# EAGLE design heimdall5 (EAGLE 8.6.3)
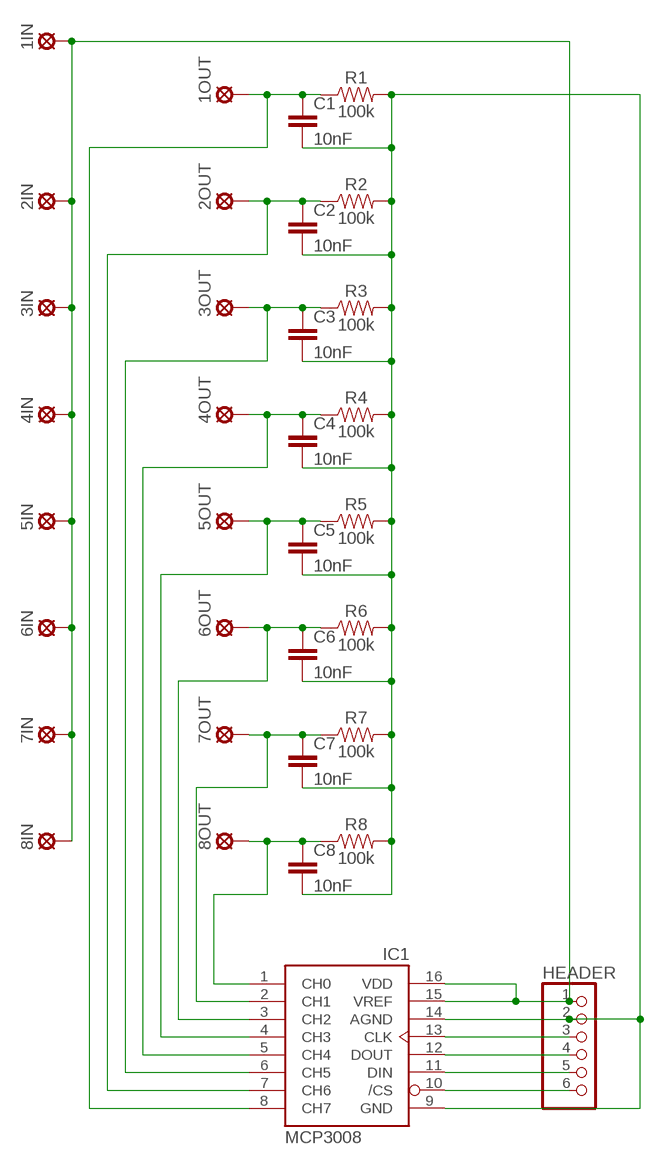
[diagram p0: schematic, sheet 1]

## Parts
1IN  LSP11  [LSP11]
1OUT  LSP11  [LSP11]
2IN  LSP11  [LSP11]
2OUT  LSP11  [LSP11]
3IN  LSP11  [LSP11]
3OUT  LSP11  [LSP11]
4IN  LSP11  [LSP11]
4OUT  LSP11  [LSP11]
5IN  LSP11  [LSP11]
5OUT  LSP11  [LSP11]
6IN  LSP11  [LSP11]
6OUT  LSP11  [LSP11]
7IN  LSP11  [LSP11]
7OUT  LSP11  [LSP11]
8IN  LSP11  [LSP11]
8OUT  LSP11  [LSP11]
C1  10nF  050X030_0502  [050X030_050]
C2  10nF  050X030_0502  [050X030_050]
C3  10nF  050X030_0502  [050X030_050]
C4  10nF  050X030_0502  [050X030_050]
C5  10nF  050X030_0502  [050X030_050]
C6  10nF  050X030_0502  [050X030_050]
C7  10nF  050X030_0502  [050X030_050]
C8  10nF  050X030_0502  [050X030_050]
HEADER  PINHD-1X6  [1X06]
IC1  MCP3008  [DIL16]
R1  100k  100KOHM-HORIZ-1/4W-1%  [AXIAL-0.3]
R2  100k  100KOHM-HORIZ-1/4W-1%  [AXIAL-0.3]
R3  100k  100KOHM-HORIZ-1/4W-1%  [AXIAL-0.3]
R4  100k  100KOHM-HORIZ-1/4W-1%  [AXIAL-0.3]
R5  100k  100KOHM-HORIZ-1/4W-1%  [AXIAL-0.3]
R6  100k  100KOHM-HORIZ-1/4W-1%  [AXIAL-0.3]
R7  100k  100KOHM-HORIZ-1/4W-1%  [AXIAL-0.3]
R8  100k  100KOHM-HORIZ-1/4W-1%  [AXIAL-0.3]

## Nets
GND: C1.2 C2.2 C3.2 C4.2 C5.2 C6.2 C7.2 C8.2 HEADER.2 IC1.9(GND) IC1.14(AGND) R1.P$2 R2.P$2 R3.P$2 R4.P$2 R5.P$2 R6.P$2 R7.P$2 R8.P$2
N$2: 2OUT.MP C2.1 IC1.7(CH6) R2.P$1
N$3: 7OUT.MP C7.1 IC1.2(CH1) R7.P$1
N$4: 3OUT.MP C3.1 IC1.6(CH5) R3.P$1
N$5: 4OUT.MP C4.1 IC1.5(CH4) R4.P$1
N$6: 5OUT.MP C5.1 IC1.4(CH3) R5.P$1
N$7: 6OUT.MP C6.1 IC1.3(CH2) R6.P$1
N$8: 8OUT.MP C8.1 IC1.1(CH0) R8.P$1
N$9: 1OUT.MP C1.1 IC1.8(CH7) R1.P$1
N$11: HEADER.3 IC1.13(CLK)
N$12: HEADER.4 IC1.12(DOUT)
N$13: HEADER.5 IC1.11(DIN)
N$14: HEADER.6 IC1.10(/CS)
PWR: 1IN.MP 2IN.MP 3IN.MP 4IN.MP 5IN.MP 6IN.MP 7IN.MP 8IN.MP HEADER.1 IC1.15(VREF) IC1.16(VDD)

## Library data of the parts
1IN 1OUT 2IN 2OUT 3IN 3OUT 4IN 4OUT 5IN 5OUT 6IN 6OUT 7IN 7OUT 8IN 8OUT = solpad:LSP11: SOLDER PAD drill 1.1 mm
C1-C8 = gm-caps-ceramic:050X030_050: 120 - 150pF Xicon Ceramic Disc 5mm lead spacing
HEADER = adafruit:PINHD-1X6: PIN HEADER
IC1 = adafruit:MCP3008
R1-R8 = SparkFun-Resistors:100KOHM: 100kΩ resistor A resistor is a passive two-terminal electrical component that implements electrical resistance as a circuit element. Resistors act to reduce current flow, and, at the same time, act to lower voltage levels within circuits. - Wikipedia; PROD_ID: RES-12184

## Board
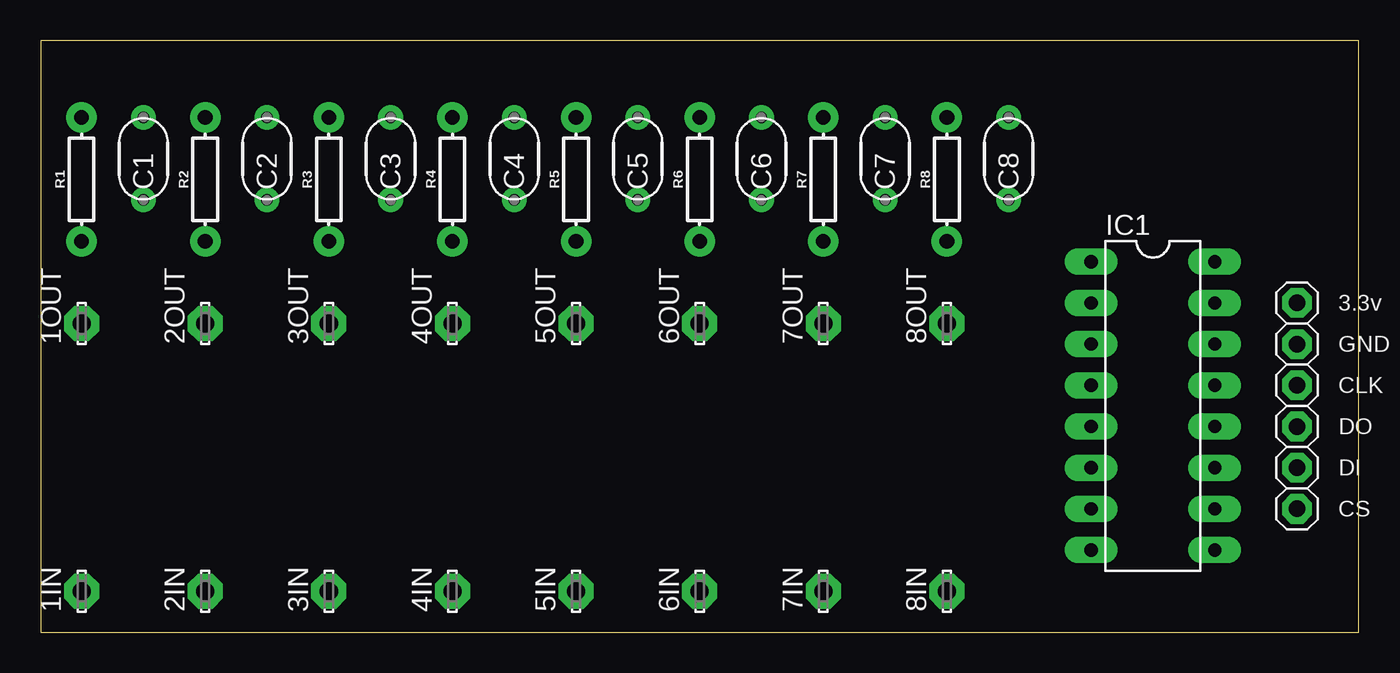
[diagram p1: board, top side]
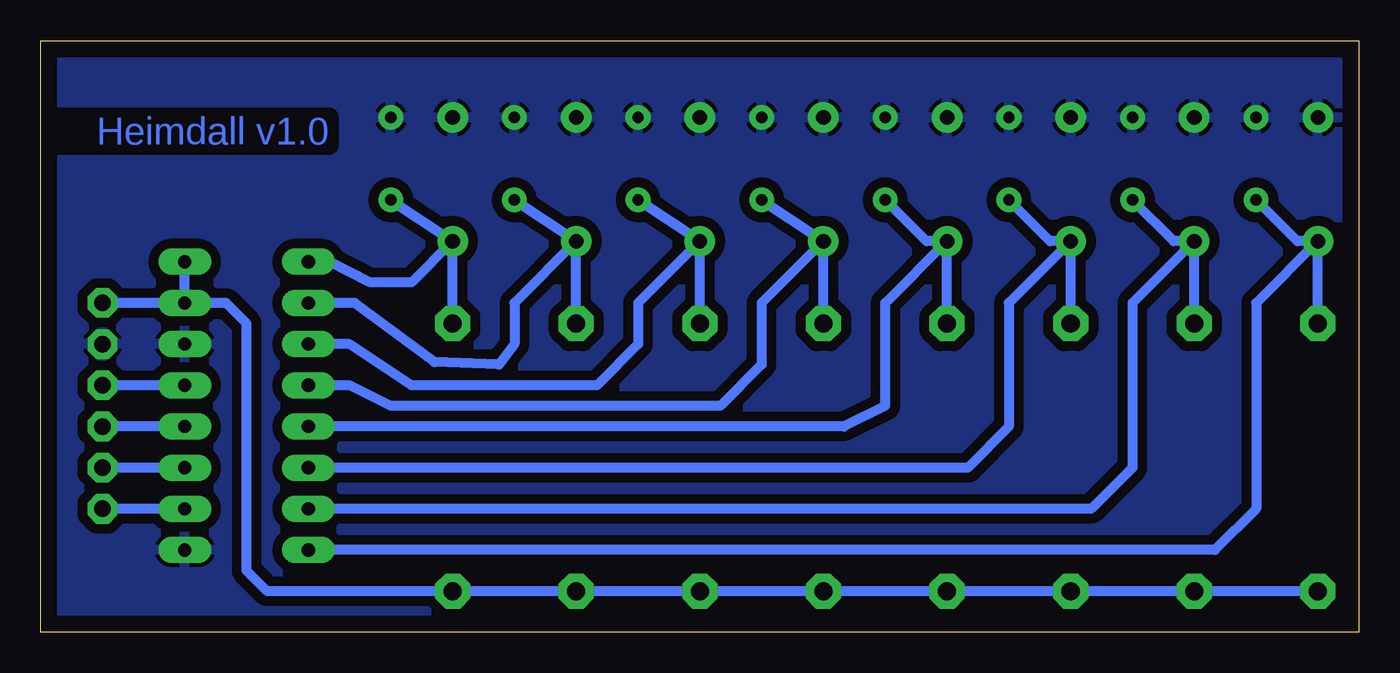
[diagram p2: board, bottom side, seen from below]

Size 81.27 x 36.5 mm. Coordinates in mm from the lower left corner, seen from the top.
Outline: 81.27,0 81.27,36.5 0,36.5 0,0 81.27,0
Copper layers (1*16): Top 0.035mm / dielectric 1.5mm / Bottom 0.035mm
Design rules "KarboDesignRules": minimum track width 12mil, minimum drill 0.6mm, track to track 8mil, track to pad 8mil, pad to pad 8mil, via to via 8mil, smd to smd 8mil, copper to edge 40mil, drill to drill 8mil, minimum pad ring 16mil, minimum via ring 12mil, stop-mask expansion 4mil, vias tented up to drill 0mil, thermal gap 10mil

### Footprints (pad centres in the part's own frame; a part is rotated, then mirrored left to right if it is on the bottom)
LSP11 = drill 1.118 pad 2.159 octagon: MP 0,0
050X030_050 = drill 0.7: 1 -2.54,0; 2 2.54,0
1X06 = drill 1.016 octagon: 1 -6.35,0; 2 -3.81,0; 3 -1.27,0; 4 1.27,0; 5 3.81,0; 6 6.35,0
DIL16 = drill 0.813 long: 1 -8.89,-3.81; 2 -6.35,-3.81; 3 -3.81,-3.81; 4 -1.27,-3.81; 5 1.27,-3.81; 6 3.81,-3.81; 7 6.35,-3.81; 8 8.89,-3.81; 9 8.89,3.81; 10 6.35,3.81; 11 3.81,3.81; 12 1.27,3.81; 13 -1.27,3.81; 14 -3.81,3.81; 15 -6.35,3.81; 16 -8.89,3.81
AXIAL-0.3 = drill 0.9 pad 1.88: P$1 -3.81,0; P$2 3.81,0

### Placement (x,y rotation side)
1IN  2.53,2.54 90 top
1OUT  2.53,19.05 90 top
2IN  10.15,2.54 90 top
2OUT  10.15,19.05 90 top
3IN  17.77,2.54 90 top
3OUT  17.77,19.05 90 top
4IN  25.39,2.54 90 top
4OUT  25.39,19.05 90 top
5IN  33.01,2.54 90 top
5OUT  33.01,19.05 90 top
6IN  40.63,2.54 90 top
6OUT  40.63,19.05 90 top
7IN  48.25,2.54 90 top
7OUT  48.25,19.05 90 top
8IN  55.87,2.54 90 top
8OUT  55.87,19.05 90 top
C1  6.34,29.21 90 top
C2  13.96,29.21 90 top
C3  21.58,29.21 90 top
C4  29.2,29.21 90 top
C5  36.82,29.21 90 top
C6  44.44,29.21 90 top
C7  52.06,29.21 90 top
C8  59.68,29.21 90 top
HEADER  77.46,13.97 270 top
IC1  68.57,13.97 270 top
R1  2.53,27.94 90 top
R2  10.15,27.94 90 top
R3  17.77,27.94 90 top
R4  25.39,27.94 90 top
R5  33.01,27.94 90 top
R6  40.63,27.94 90 top
R7  48.25,27.94 90 top
R8  55.87,27.94 90 top

### Tracks (layer width: path | path; a pad name or v marks a point on that pad's centre or on a via)
GND
  pour Bottom (isolate 0.61): -0.01,0 -0.01,36.83 81.27,36.83 81.27,0
N$2
  Bottom 0.61: R2.P$1 13.96,20.32 13.96,10.16 16.5,7.62 IC1.7 | 2OUT.MP R2.P$1 | R2.P$1 11.42,24.13 C2.1
N$3
  Bottom 0.61: 7OUT.MP R7.P$1 | R7.P$1 52.06,20.32 52.06,17.78 53.02,16.51 56.98,16.67 61.91,20.32 IC1.2 | R7.P$1 48.33,24.21 C7.1
N$4
  Bottom 0.61: R3.P$1 21.58,20.32 21.58,12.7 24.12,10.16 IC1.6 | 3OUT.MP R3.P$1 | R3.P$1 17.85,24.21 | R3.P$1 19.04,24.13 C3.1
N$5
  Bottom 0.61: 4OUT.MP R4.P$1 | R4.P$1 25.47,24.21 | R4.P$1 29.2,20.32 29.2,13.97 31.74,12.7 IC1.5 | R4.P$1 26.66,24.13 C4.1
N$6
  Bottom 0.61: 5OUT.MP R5.P$1 | R5.P$1 33.09,24.21 C5.1 | R5.P$1 36.82,20.32 36.82,16.51 39.36,13.97 59.68,13.97 62.22,15.24 IC1.4
N$7
  Bottom 0.61: 6OUT.MP R6.P$1 | C6.1 40.71,24.21 R6.P$1 | R6.P$1 44.44,20.32 44.44,17.78 46.98,15.24 58.41,15.24 62.22,17.78 IC1.3
N$8
  Bottom 0.61: 8OUT.MP R8.P$1 | R8.P$1 55.95,24.21 C8.1 | R8.P$1 58.41,21.59 60.95,21.59 63.49,22.86 IC1.1
N$9
  Bottom 0.61: R1.P$1 6.34,20.32 6.34,7.62 8.88,5.08 IC1.8 | 1OUT.MP R1.P$1 | R1.P$1 3.8,24.13 C1.1
N$11
  Bottom 0.61: IC1.13 HEADER.3
N$12
  Bottom 0.61: IC1.12 HEADER.4
N$13
  Bottom 0.61: IC1.11 HEADER.5
N$14
  Bottom 0.61: IC1.10 HEADER.6
PWR
  Bottom 0.61: IC1.15 HEADER.1 | 1IN.MP 2IN.MP 3IN.MP 4IN.MP 5IN.MP 6IN.MP 7IN.MP 8IN.MP 67.3,2.54 68.57,3.81 68.57,19.05 69.84,20.32 IC1.15 | IC1.15 IC1.16

### Text on the board
Bottom: Heimdall v1.0
tNames: 3.3v | GND | CLK | DO | DI | CS